# Altium schematic sheet Mechanical.SchDoc: Mechanical
size Letter; Revision: 1.0; SheetNumber: 9; PageSetup: Record=PageOptions|CenterHorizontal=True|CenterVertical=True|PrintScale=1.00|XCorrection=1.00|YCorrection=1.00|PrintKind=1|BorderSize=5000000|LeftOffset=0|BottomOffset=0|Orientation=2|PaperLength=1000|PaperWidth=1000|Scale=100|PaperSource=7|PrintQuality=-3|MediaType=1|DitherType=10|PrintScaleMode=1|PaperKind=Letter|PaperIndex=1; ProjectTitle: Data Acquisition System
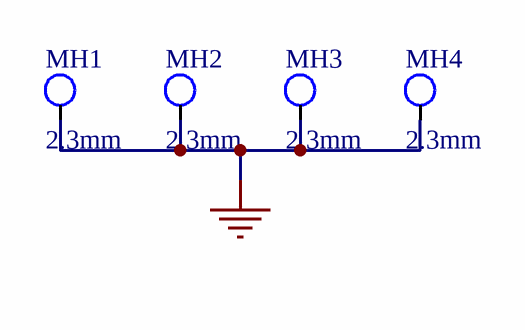
[diagram p0: Mechanical.SchDoc]

## Parts
MH1  2.3mm  [MH-2.3mm]
MH2  2.3mm  [MH-2.3mm]
MH3  2.3mm  [MH-2.3mm]
MH4  2.3mm  [MH-2.3mm]

## Nets
GND: MH1.1 MH2.1 MH3.1 MH4.1

## Notes on the sheet
- Date:
- Revision:
- Sheet
- of

## Library data of the parts
MH1-MH4 = MH-2.3mm: Mounting Hole 2.3mm